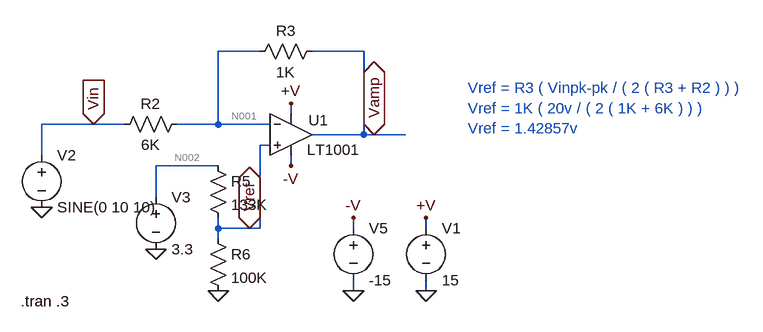
[diagram p0: schematic LTSpice simulation.asc]
LTSpice simulation.asc, the LTspice schematic file:
Version 4
SHEET 1 2168 1300
WIRE 48 64 -16 64
WIRE 208 64 128 64
WIRE 96 160 96 144
WIRE -208 176 -288 176
WIRE -160 176 -208 176
WIRE -16 176 -16 64
WIRE -16 176 -80 176
WIRE 64 176 -16 176
WIRE 208 192 208 64
WIRE 208 192 128 192
WIRE 224 192 208 192
WIRE 272 192 224 192
WIRE 64 208 48 208
WIRE -288 224 -288 176
WIRE -16 240 -112 240
WIRE 96 240 96 224
WIRE -112 288 -112 240
WIRE -16 336 -16 320
WIRE 32 336 -16 336
WIRE 48 336 48 208
WIRE 48 336 32 336
WIRE 192 336 192 320
WIRE 304 336 304 320
WIRE -16 352 -16 336
WIRE 192 432 192 416
WIRE 304 432 304 416
FLAG 304 432 0
FLAG 96 144 +V
FLAG 304 320 +V
FLAG 192 432 0
FLAG 192 320 -V
FLAG 96 240 -V
FLAG -288 304 0
FLAG -208 176 Vin
IOPIN -208 176 In
FLAG -112 368 0
FLAG 224 192 Vamp
IOPIN 224 192 BiDir
FLAG -16 432 0
FLAG 32 336 Vref
IOPIN 32 336 BiDir
SYMBOL voltage 304 320 R0
WINDOW 123 0 0 Left 2
WINDOW 39 0 0 Left 2
SYMATTR InstName V1
SYMATTR Value 15
SYMBOL res -64 160 R90
WINDOW 0 0 56 VBottom 2
WINDOW 3 32 56 VTop 2
SYMATTR InstName R2
SYMATTR Value 6K
SYMBOL res 144 48 R90
WINDOW 0 0 56 VBottom 2
WINDOW 3 32 56 VTop 2
SYMATTR InstName R3
SYMATTR Value 1K
SYMBOL Opamps\\LT1001 96 128 R0
WINDOW 0 27 42 Left 2
WINDOW 3 25 87 Left 2
SYMATTR InstName U1
SYMBOL voltage 192 320 R0
WINDOW 123 0 0 Left 2
WINDOW 39 0 0 Left 2
SYMATTR InstName V5
SYMATTR Value -15
SYMBOL voltage -288 208 R0
WINDOW 123 0 0 Left 0
WINDOW 39 0 0 Left 0
SYMATTR InstName V2
SYMATTR Value SINE(0 10 10)
SYMBOL voltage -112 272 R0
WINDOW 123 0 0 Left 0
WINDOW 39 0 0 Left 0
SYMATTR InstName V3
SYMATTR Value 3.3
SYMBOL res -32 224 R0
SYMATTR InstName R5
SYMATTR Value 133K
SYMBOL res -32 336 R0
SYMATTR InstName R6
SYMATTR Value 100K
TEXT -320 448 Left 2 !.tran .3
TEXT 368 120 Left 2 ;Vref = R3 ( Vinpk-pk / ( 2 ( R3 + R2 ) ) )\nVref = 1K ( 20v / ( 2 ( 1K + 6K ) ) )\nVref = 1.42857v

The netlist it stands for:
* LTSpice simulation.asc
V1 +V 0 15
R2 N001 Vin 6K
R3 Vamp N001 1K
XU1 Vref N001 +V -V Vamp LT1001  ; pins In+ In- V+ V- OUT
V5 -V 0 -15
V2 Vin 0 SINE(0 10 10)
V3 N002 0 3.3
R5 N002 Vref 133K
R6 Vref 0 100K
.tran .3
* Vref = R3 ( Vinpk-pk / ( 2 ( R3 + R2 ) ) )
* Vref = 1K ( 20v / ( 2 ( 1K + 6K ) ) )
* Vref = 1.42857v
.lib LTC.lib
.backanno
.end

* Results of the author's LTspice run, read from the files saved beside the schematic
* Operating Point, zero values left out:
*   V(+v) = 15 V
*   V(n001) = 1.416 V
*   V(vamp) = 1.652 V
*   V(vref) = 1.416 V
*   V(-v) = -15 V
*   V(n002) = 3.3 V
*   I(R6) = 14.16 µA
*   I(R5) = 14.16 µA
*   I(R3) = 236.1 µA
*   I(R2) = 236.1 µA
*   I(V3) = -14.16 µA
*   I(V2) = 236.1 µA
*   I(V5) = 2.134 mA
*   I(V1) = -2.37 mA
*   Ix(u1:1) = 2.559 pA
*   Ix(u1:2) = 2.499 pA
*   Ix(u1:3) = 2.37 mA
*   Ix(u1:4) = -2.134 mA
*   Ix(u1:5) = -236.1 µA
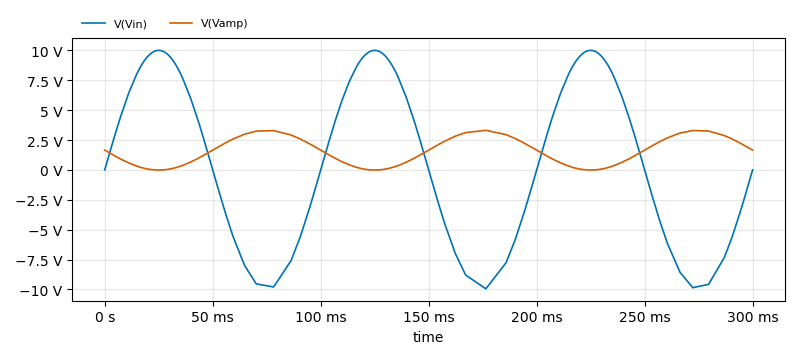
[diagram p1: Transient Analysis of LTSpice simulation.asc, plotted from the saved traces]
* Transient Analysis, 1 run:
*   V(Vin): min -9.949 V, max 9.999 V, average 43.06 mV, rms 7.034 V, last 0 V
*   V(Vamp): min -14.16 mV, max 3.31 V, average 1.645 V, rms 2.02 V, last 1.652 V